# Altium schematic sheet MCU.SchDoc
size A4
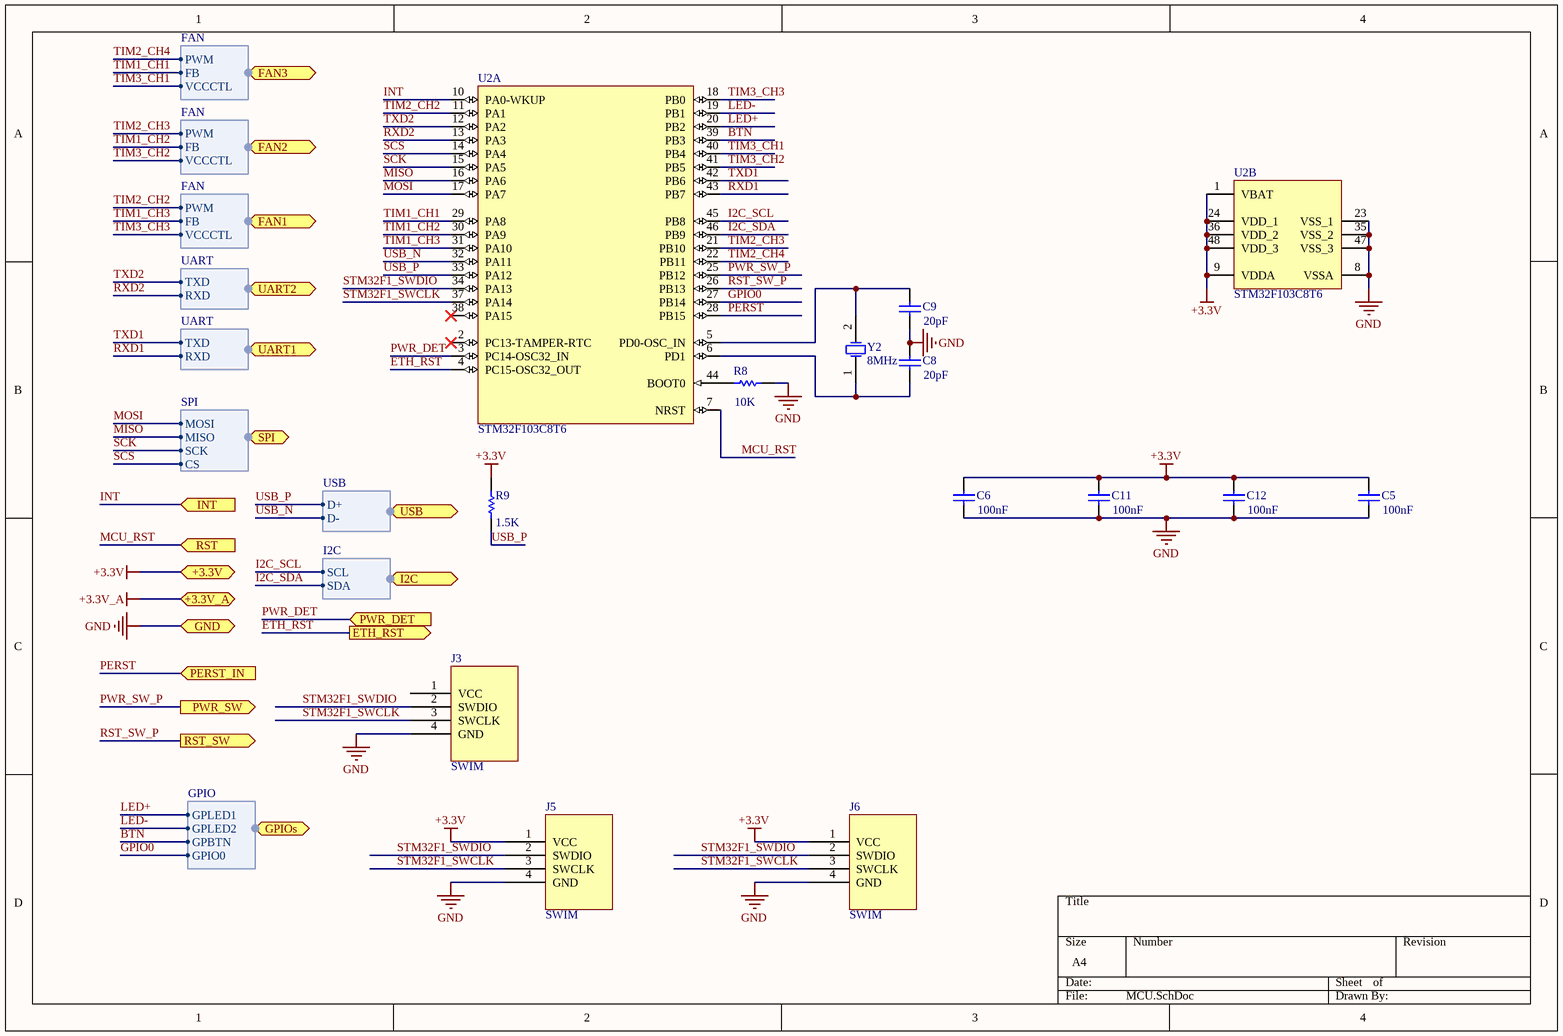
[diagram p0: MCU.SchDoc]

## Parts
C5  value 100nF  [C-1608[0603]]
C6  value 100nF  [C-1608[0603]]
C8  value 20pF  [C-1608[0603]]
C9  value 20pF  [C-1608[0603]]
C11  value 100nF  [C-1608[0603]]
C12  value 100nF  [C-1608[0603]]
J3  SWIM  [SIP4]
J5  SWIM  [SWD_SOCKET]
J6  SWIM  [SWD_HEADER]
R8  value 10K  [R-1608[0603]]
R9  value 1.5K  [R-1608[0603]]
U2  STM32F103C8T6  [TQFP48_N]  (parts A,B of 2)
Y2  8MHz  [LC-SMD-5032_2P]

## Ports
+3.3V, +3.3V_A, ETH_RST (out), FAN1 (harness FAN), FAN2 (harness FAN), FAN3 (harness FAN), GND, GPIOs (harness GPIO), I2C (harness I2C), INT (in), PERST_IN (in), PWR_DET (in), PWR_SW (out), RST (in), RST_SW (out), SPI (harness SPI), UART1 (harness UART), UART2 (harness UART), USB (harness USB)

## Harnesses
SPI: MOSI, MISO, SCK, CS
UART: TXD, RXD
USB: D+, D-
I2C: SCL, SDA
GPIO: GPLED1, GPLED2, GPBTN, GPIO0
FAN: PWM, FB, VCCCTL

## Nets
+3.3V: C5.2 C6.2 C11.2 C12.2 J5.1(VCC) J6.1(VCC) R9.2 U2.1(VBAT) U2.9(VDDA) U2.24(VDD_1) U2.36(VDD_2) U2.48(VDD_3) ; port +3.3V
+3.3V_A: port +3.3V_A
GND: C5.1 C6.1 C8.2 C9.1 C11.1 C12.1 J3.4(GND) J5.4(GND) J6.4(GND) R8.2 U2.8(VSSA) U2.23(VSS_1) U2.35(VSS_2) U2.47(VSS_3) ; port GND
BTN: U2.39(PB3) ; port GPIOs.GPBTN
ETH_RST: U2.4(PC15-OSC32_OUT) ; port ETH_RST
GPIO0: U2.27(PB14) ; port GPIOs.GPIO0
I2C_SCL: U2.45(PB8) ; port I2C.SCL
I2C_SDA: U2.46(PB9) ; port I2C.SDA
INT: U2.10(PA0-WKUP) ; port INT
LED+: U2.20(PB2) ; port GPIOs.GPLED1
LED-: U2.19(PB1) ; port GPIOs.GPLED2
MCU_RST: U2.7(NRST) ; port RST
MISO: U2.16(PA6) ; port SPI.MISO
MOSI: U2.17(PA7) ; port SPI.MOSI
PERST: U2.28(PB15) ; port PERST_IN
PWR_DET: U2.3(PC14-OSC32_IN) ; port PWR_DET
PWR_SW_P: U2.25(PB12) ; port PWR_SW
RST_SW_P: U2.26(PB13) ; port RST_SW
RXD1: U2.43(PB7) ; port UART1.RXD
RXD2: U2.13(PA3) ; port UART2.RXD
SCK: U2.15(PA5) ; port SPI.SCK
SCS: U2.14(PA4) ; port SPI.CS
STM32F1_SWCLK: J3.3(SWCLK) J5.3(SWCLK) J6.3(SWCLK) U2.37(PA14)
STM32F1_SWDIO: J3.2(SWDIO) J5.2(SWDIO) J6.2(SWDIO) U2.34(PA13)
TIM1_CH1: U2.29(PA8) ; port FAN3.FB
TIM1_CH2: U2.30(PA9) ; port FAN2.FB
TIM1_CH3: U2.31(PA10) ; port FAN1.FB
TIM2_CH2: U2.11(PA1) ; port FAN1.PWM
TIM2_CH3: U2.21(PB10) ; port FAN2.PWM
TIM2_CH4: U2.22(PB11) ; port FAN3.PWM
TIM3_CH1: U2.40(PB4) ; port FAN3.VCCCTL
TIM3_CH2: U2.41(PB5) ; port FAN2.VCCCTL
TIM3_CH3: U2.18(PB0) ; port FAN1.VCCCTL
TXD1: U2.42(PB6) ; port UART1.TXD
TXD2: U2.12(PA2) ; port UART2.TXD
USB_N: U2.32(PA11) ; port USB.D-
USB_P: R9.1 U2.33(PA12) ; port USB.D+
NetC8_1: C8.1 U2.6(PD1) Y2.1(OSC1)
NetC9_2: C9.2 U2.5(PD0-OSC_IN) Y2.2(OSC2)
NetR8_1: R8.1 U2.44(BOOT0)

Not connected (* = marked no-connect by the designer): J3 1(VCC); U2 2(PC13-TAMPER-RTC)* 38(PA15)*

## Library data of the parts
C5 C6 C8 C9 C11 C12 = Cap Semi: Capacitor (Semiconductor SIM Model); Published: 8-Jun-2000; LatestRevisionDate: 29-May-2009; LatestRevisionNote: IPC-7351 Footprint Added.; PackageReference: C1206; Publisher: Altium Limited; PackageDescription: Chip Capacitor
J3 J5 J6 = SWD
R8 R9 = Res Semi: Semiconductor Resistor; Published: 8-Jun-2000; LatestRevisionDate: 17-Jul-2002; LatestRevisionNote: Re-released for DXP Platform.; PackageReference: AXIAL-0.5; Publisher: Altium Limited; PackageDescription: Axial Device, Thru-Hole; 2 Leads; 0.5 in Pin Spacing
U2 = STM32F103C8T6: ARM; ComponentLink1Description: 供应商链接; ComponentLink1URL: http://www.szlcsc.com/product/details_9243.html; Package: LQFP-48_7x7x05P; Supplier: LC; SuppliersPartNumber: C8734
Y2 = XTAL: Crystal Oscillator; Published: 8-Jun-2000; LatestRevisionDate: 17-Jul-2002; LatestRevisionNote: Re-released for DXP Platform.; PackageReference: R38; Publisher: Altium Limited; PackageDescription: Crystal, Thru-Hole; 2 Leads; Body 3.1 x 8.2 mm (Dia.xH)